# Altium schematic sheet Sheet1.SchDoc
size A; SheetNumber: 1; SheetTotal: 1
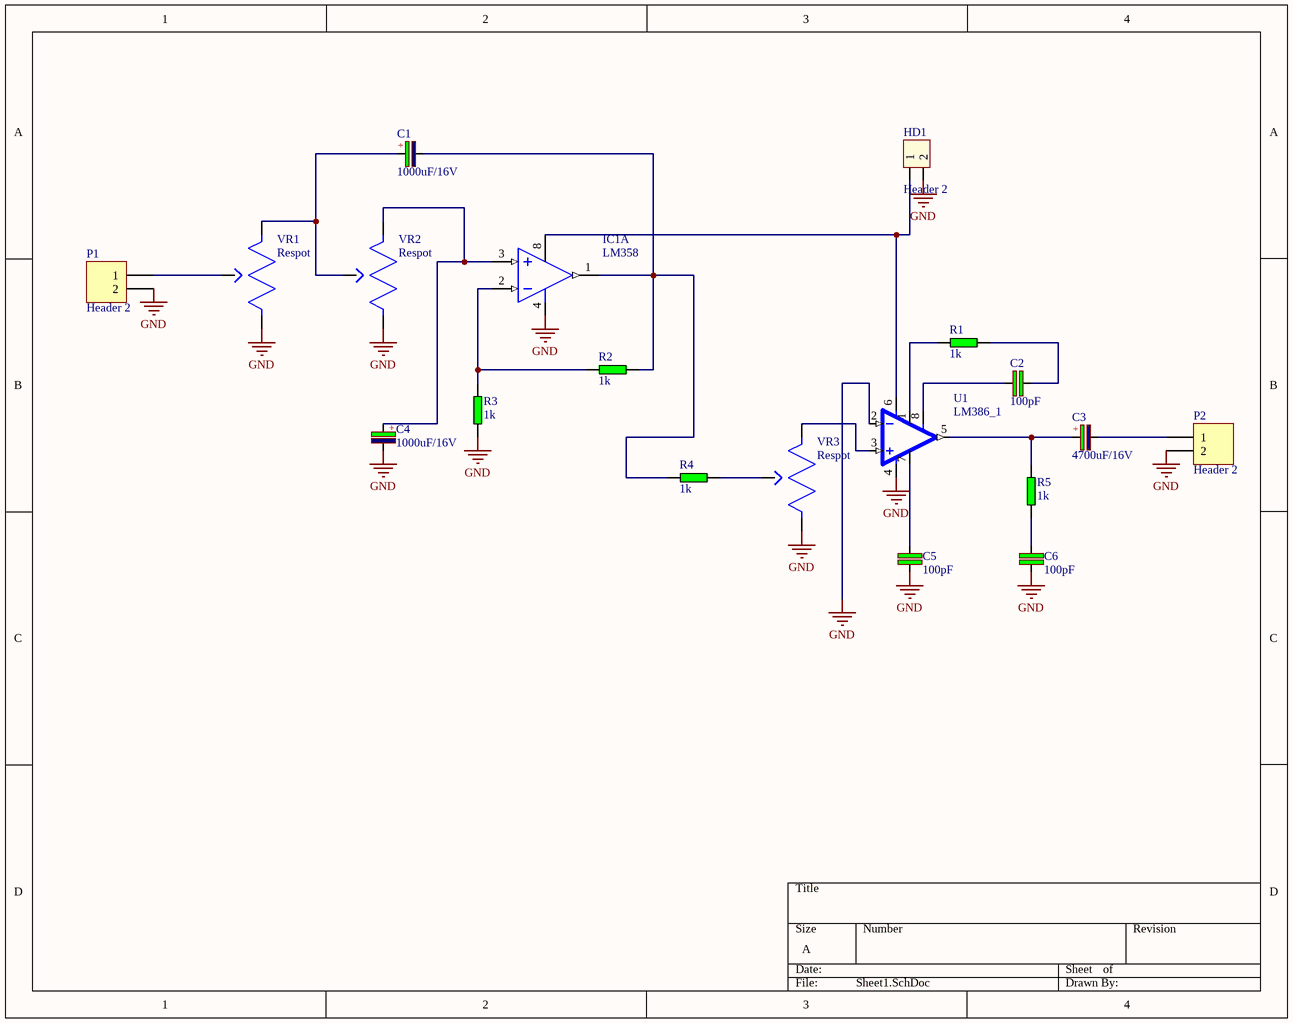
[diagram p0: Sheet1.SchDoc]

## Parts
C1  1000uF/16V  [CP1.5/3.4]
C2  100pF  [CN1]
C3  4700uF/16V  [CP3/7]
C4  1000uF/16V  [CP1.5/3.4]
C5  100pF  [CN1]
C6  100pF  [CN1]
HD1  Header 2  [HED2]
IC1  LM358  [DIP8/W0.3]  (part A of 2)
P1  Header 2  [HDR1X2]
P2  Header 2  [HDR1X2]
R1  1k  [R1/4W]
R2  1k  [R1/4W]
R3  1k  [R1/4W]
R4  1k  [R1/4W]
R5  1k  [R1/4W]
U1  LM386_1  [lm386]
VR1  Respot  [Respot]
VR2  Respot  [Respot]
VR3  Respot  [Respot]

## Nets
GND: C4.2 C5.1 C6.1 HD1.2 IC1.4(-V) P1.2 P2.2 R3.1 U1.2(-IN) U1.4(V-) VR1.3 VR2.3 VR3.3
NetC1_1: C1.1 VR1.1 VR2.2
NetC1_2: C1.2 IC1.1(OUT) R2.2 R4.1
NetC2_1: C2.1 U1.8(GAIN@8)
NetC2_2: C2.2 R1.2
NetC3_1: C3.1 R5.2 U1.5(OUT)
NetC3_2: C3.2 P2.1
NetC4_1: C4.1 IC1.3(IN+) VR2.1
NetC5_2: C5.2 U1.7(BP)
NetC6_2: C6.2 R5.1
NetHD1_1: HD1.1 IC1.8(+V) U1.6(V+)
NetIC1_2: IC1.2(IN-) R2.1 R3.2
NetP1_1: P1.1 VR1.2
NetR1_1: R1.1 U1.1(GAIN@1)
NetR4_2: R4.2 VR3.2
NetU1_3: U1.3(+IN) VR3.1

## Notes on the sheet
- (in symbol CP4) +
- (in symbol CP6) +

## Library data of the parts
C1 C4 = CP4: Cap 1000uF/16V - 220uF/50V; Description 5: 4,7uF>10uF/250V_3,3uF>10uF/400V - 2,2uF>4,7uF/450V; Description 1: 2200uF-3300uF/6,3V - 1000uF-2200uF/10V; Description 2: 1000uF/16V - 470uF => 1000uF/25V - 100uF/100V; Description 3: 330uF>470uF/35V_220uF>470uF/50V_10uF>22uF/250V; Description 4: 220uF => 330uF/63V - 10uF =>33uF/160 - 200V; Value: 1000uF/16V
C2 C5 C6 = CAP: Cap np  1pF - 472pF; Value: 100pF
C3 = CP6: Cap 4700uF/16V - 2200uF/50V; Description 5: 100uF=>220uF/200V -100uF=>330uF/350V; Description 1: 10KuF=>22KuF/6,3V - 6800uF=>15KuF/10V; Description 2: 4700uF=>10KuF/16V - 3300uF => 6800uF/25V; Description 3: 2200uF=>3300uF/50V_1KuF=>2200uF/63V; Description 4: 470uF => 1KuF/100V - 220uF-470uF/160V; Value: 2200uF/16V; Description 6: 33uF=>100/350V-400V  -  22uF=>33uF/450V
HD1 = Hed2: Header 2 (Green); Value: Header 2
IC1 = LM358: Low-Power Dual Operational Amplifier; Value: LM358
P1 P2 = Header 2: Header, 2-Pin; LatestRevisionDate: 17-Jul-2002; LatestRevisionNote: Re-released for DXP Platform.; Publisher: Altium Limited
R1-R5 = RES: Resistor 1/4W; Value: R1/4W - 1K
U1 = LM386_1: low voltage audio power amplifier; MP: LM386; Price: None; Package: None; Value: *; Availability: Unavailable
VR1-VR3 = Respot: 500k Ohm 1 Gang Linear Panel Mount Potentiometer None 1 Turn Conductive Plastic 0.2W, 1/5W PC Pins; MF: TT Electronics/BI; MP: P160KN-0QC15B500K; Value: *; Digi-Key_Part_Number: 987-1304-ND; Package: None; Digi-Key_Purchase_URL: https://www.digikey.cz/product-detail/en/tt-electronics-bi/P160KN-0QC15B500K/987-1304-ND/2408881?utm_source=snapeda&utm_medium=aggregator&utm_campaign=symbol; SnapEDA_Link: https://www.snapeda.com/parts/P160KN-0QC15B500K/TT%20Electronics/BI/view-part/903272/?ref=snap